# EAGLE design PowerPCB_180 (EAGLE 7.5.0)
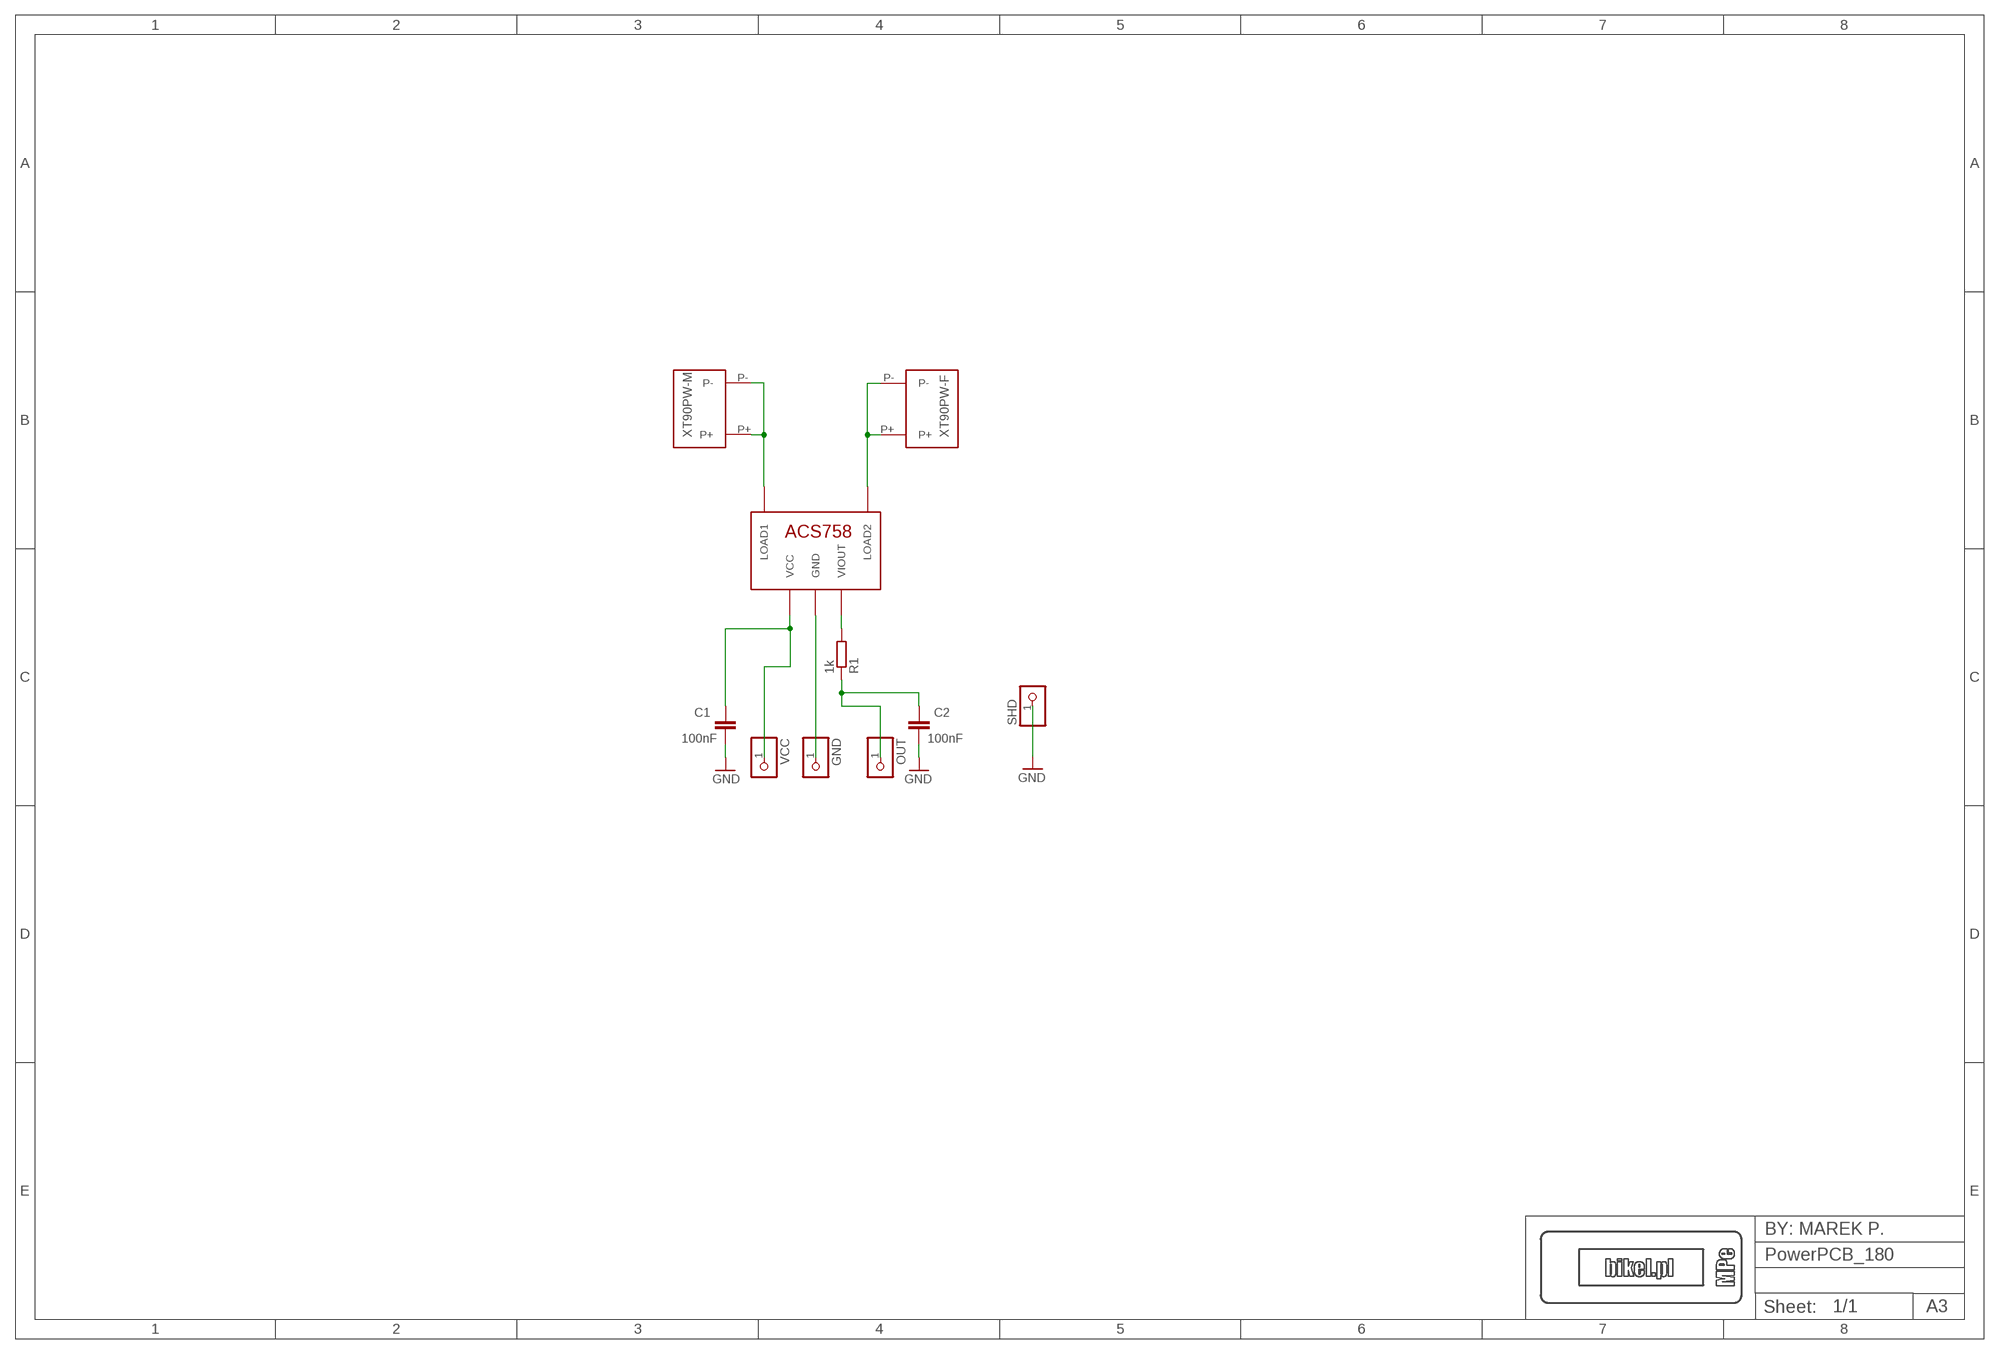
[diagram p0: schematic, sheet 1]

## Parts
ACS758_1  ACS758  [ACS758-PFF]
C1  100nF  C-EUC0805  [C0805]
C2  100nF  C-EUC0805  [C0805]
GND  PINHD-1X1  [1X01]
OUT  PINHD-1X1  [1X01]
R1  1k  R-EU_R0805  [R0805]
SHD  PINHD-1X1  [1X01]
VCC  PINHD-1X1  [1X01]
XT90PW-F1  XT90PW-F  [XT90PW-F]
XT90PW-M1  XT90PW-M  [XT90PW-M]

## Nets
GND: ACS758_1.GND C1.2 C2.2 GND.1 SHD.1
N$1: ACS758_1.VIOUT R1.2
N$2: C2.1 OUT.1 R1.1
N$4: ACS758_1.LOAD1 XT90PW-M1.P+ XT90PW-M1.P-
N$5: ACS758_1.LOAD2 XT90PW-F1.P+ XT90PW-F1.P-
N$8: ACS758_1.VCC C1.1 VCC.1

## Library data of the parts
ACS758_1 = _marek:ACS758
C1 C2 = resistor:C-EU: CAPACITOR, European symbol
GND OUT SHD VCC = pinhead:PINHD-1X1: PIN HEADER
R1 = resistor:R-EU_: RESISTOR, European symbol
XT90PW-F1 = _marek:XT90PW-F
XT90PW-M1 = _marek:XT90PW-M

## Board
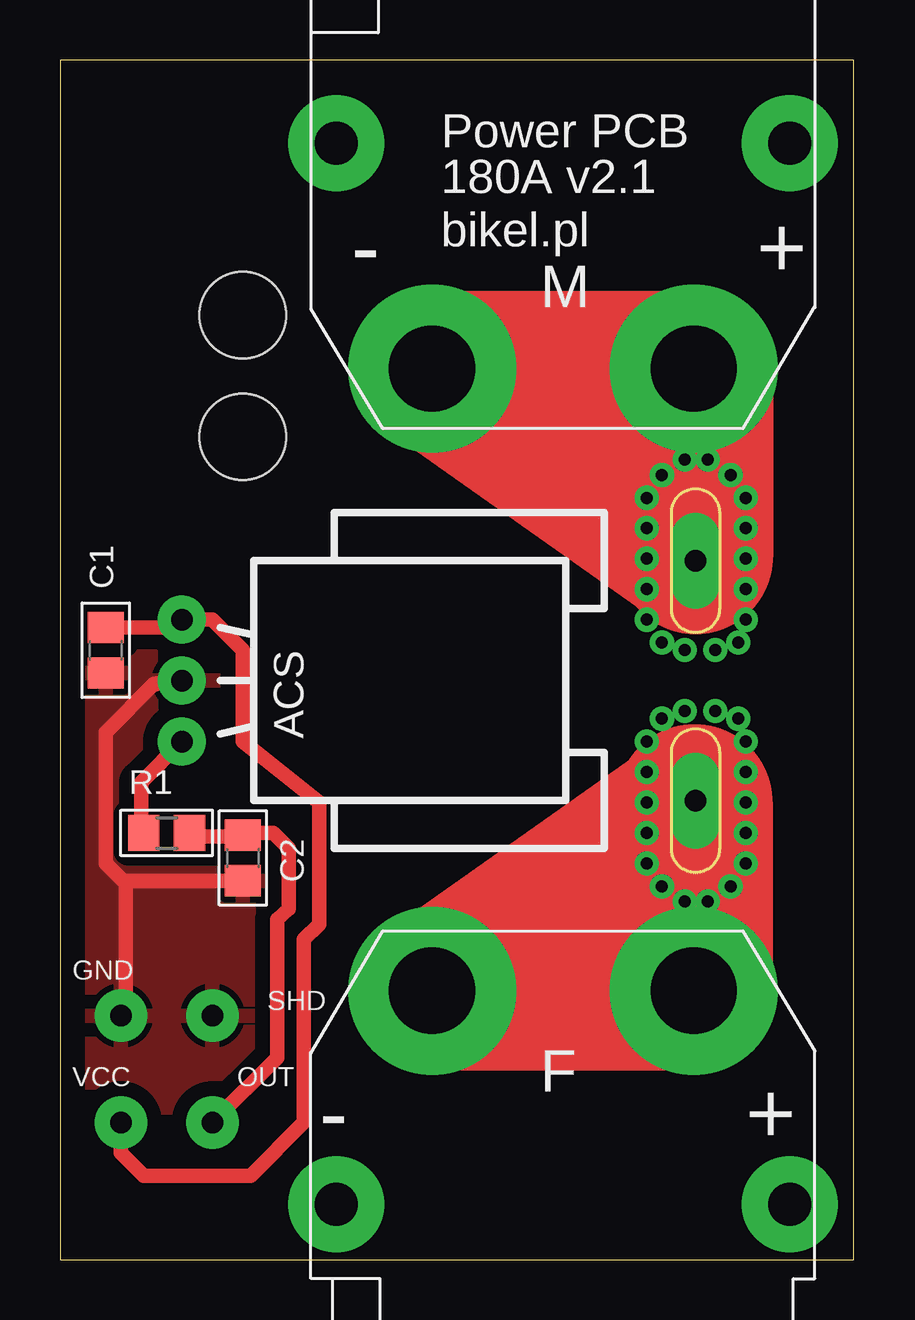
[diagram p1: board, top side]
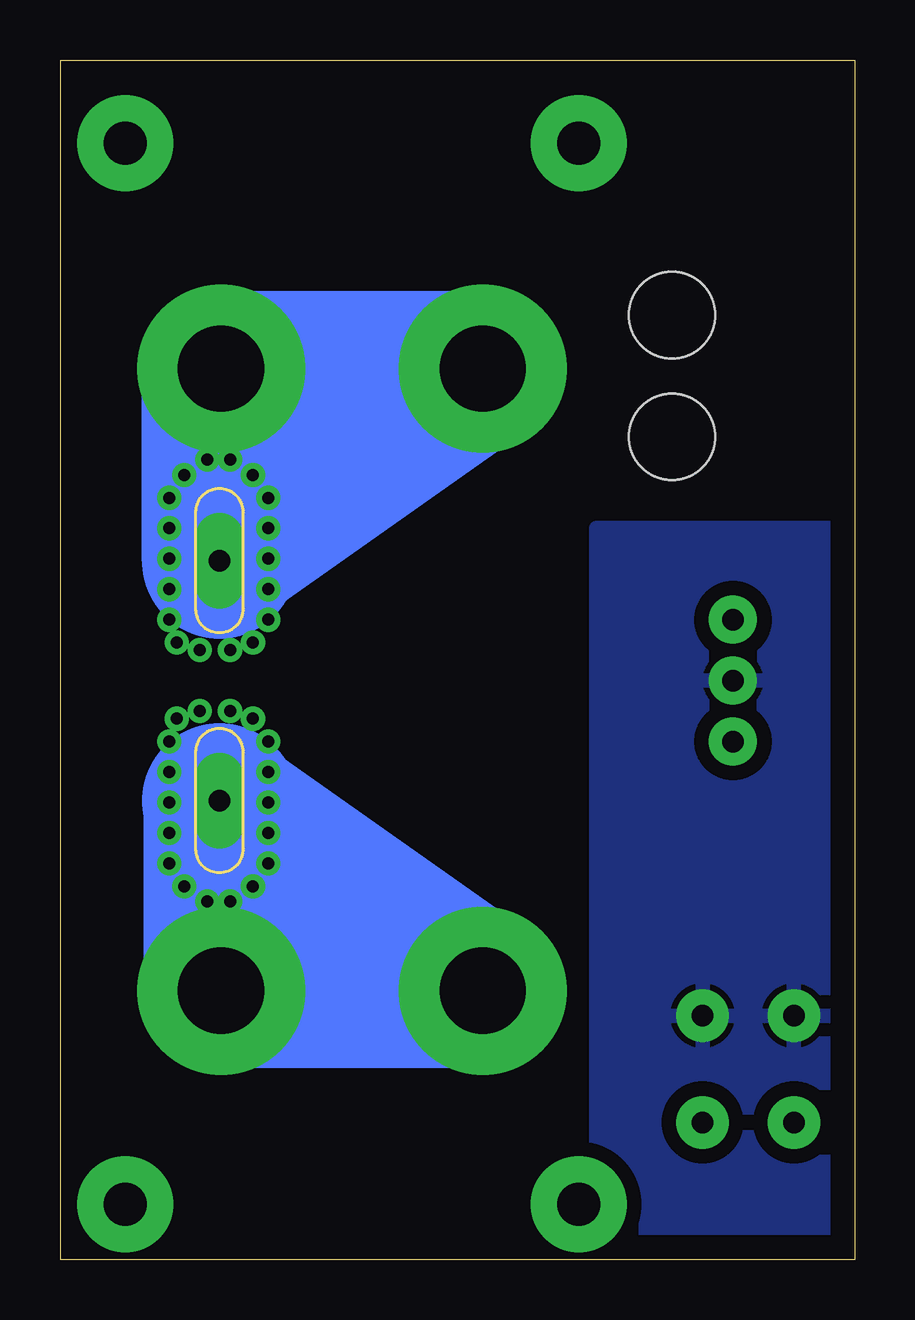
[diagram p2: board, bottom side, seen from below]

Size 33.08 x 50 mm. Coordinates in mm from the lower left corner, seen from the top.
Outline: 0,0 33.08,0 33.08,50 0,50 0,0
Copper layers (1*16): Top 0.035mm / dielectric 1.5mm / Bottom 0.035mm
Design rules "default *": minimum track width 10mil, minimum drill 24mil, track to track 8mil, track to pad 8mil, pad to pad 8mil, via to via 8mil, smd to smd 8mil, copper to edge 40mil, drill to drill 8mil, minimum pad ring 10mil, minimum via ring 8mil, stop-mask expansion 4mil, vias tented up to drill 0.6mm, thermal gap 10mil
Holes 3.6 mm at 7.62,39.37 7.62,34.29

### Footprints (pad centres in the part's own frame; a part is rotated, then mirrored left to right if it is on the bottom)
ACS758-PFF = drill 0.9 pad 2: GND 0,0; VCC -2.54,0; VIOUT 2.54,0 | drill 0.9 pad 2 long: LOAD1 -5,21.4; LOAD2 5,21.4 | drill 0.5 pad 0.61: P$1 -5.08,23.495; P$2 -5.08,19.367; P$3 -1.27,22.225; P$4 -1.27,20.955; P$5 -3.81,23.495; P$6 -2.54,23.495; P$7 -1.587,23.177; P$8 -1.587,20.003; P$9 -2.54,19.367; P$10 -3.81,19.367; P$11 -6.35,19.367; P$12 -7.62,19.367; P$13 -8.572,20.003; P$14 -9.207,20.955; P$15 -9.207,21.907; P$16 -8.572,22.86; P$17 -7.62,23.495; P$18 -6.35,23.495; P$19 1.587,23.177; P$20 2.54,23.495; P$21 3.81,23.495; P$22 5.08,23.495; P$23 6.35,23.495; P$24 7.62,23.495; P$25 8.572,22.86; P$26 9.207,21.907; P$27 9.207,20.955; P$28 8.572,20.003; P$29 7.62,19.367; P$30 6.35,19.367; P$31 5.08,19.367; P$32 3.81,19.367; P$33 2.54,19.367; P$34 1.587,20.003; P$35 1.27,20.955; P$36 1.27,22.225
C0805 = smd 1.3 x 1.5: 1 -0.95,0; 2 0.95,0
1X01 = drill 0.9 pad 2.184: 1 0,0
R0805 = smd 1.3 x 1.5: 1 -0.95,0; 2 0.95,0
XT90PW-F = drill 1.8 pad 4: P$3 -9.45,-8.9; P$4 9.45,-8.9 | drill 3.6 pad 7: P+ 5.45,0; P- -5.45,0
XT90PW-M = drill 1.8 pad 4: P$3 -9.45,-9.4; P$4 9.45,-9.4 | drill 3.6 pad 7: P+ -5.45,0; P- 5.45,0

### Placement (x,y rotation side)
ACS758_1  5.08,24.13 270 top
C1  1.91,25.4 270 top
C2  7.62,16.74 270 top
GND  2.54,10.16 0 top
OUT  6.35,5.71 0 top
R1  4.45,17.78 180 top
SHD  6.35,10.16 0 top
VCC  2.54,5.71 0 top
XT90PW-F1  20.95,11.2 0 top
XT90PW-M1  20.95,37.13 180 top

### Tracks (layer width: path | path; a pad name or v marks a point on that pad's centre or on a via)
GND
  Top 0.254: 5.05,24 ACS758_1.GND 5.28,24.23
  Top 0.61: 5.05,24 4,24 3.97,23.97 3.9,23.98 1.91,21.96 1.91,16.51 2.63,15.79 | 2.63,15.79 C2.2 | 2.74,10.26 2.74,15.67 2.63,15.79
  Bottom 0.61: 5.28,24.23 ACS758_1.GND
  pour Top (isolate 0.61): -2.54,31.75 11.43,31.75 11.43,-1.27 -2.54,-1.27
  pour Bottom (isolate 0.61): -0.64,30.48 10.77,30.48 10.77,-0.18 -0.64,0
N$1
  Top 0.254: 3.38,17.83 R1.2
  Top 0.61: 3.38,17.83 3.38,19.89 ACS758_1.VIOUT
N$2
  Top 0.254: 7.44,17.63 C2.1
  Top 0.61: 7.44,17.63 5.39,17.63 R1.1 | C2.1 7.71,17.78 8.89,17.78 9.53,17.14 9.53,14.61 9.04,14.17 9.04,8.41 OUT.1
N$3
  Bottom 6.452: 15.56,37.15 26.35,29.53
N$4
  Bottom 6.452: 26.48,29.11 ACS758_1.LOAD1 26.48,37.06 XT90PW-M1.P+ XT90PW-M1.P-
N$5
  Bottom 6.452: ACS758_1.LOAD2 26.41,19.05 XT90PW-F1.P+ XT90PW-F1.P-
N$6
  Top 6.452: 26.42,19.07 26.47,19.07 26.47,11.18
N$7
  Top 6.452: 26.48,37.21 26.48,29.29
N$8
  Top 0.61: VCC.1 2.54,4.45 3.49,3.49 7.94,3.49 10.16,5.71 10.16,13.34 10.79,13.97 10.79,19.05 7.62,21.59 7.62,25.4 6.35,26.67 ACS758_1.VCC 4.76,26.35 C1.1
N$9
  Bottom 6.452: 15.56,11.11 26.35,18.73
N$10
  Top 6.452: 26.67,37.15 15.56,37.15 26.35,29.53
N$11
  Top 6.452: 26.35,11.11 15.56,11.11 26.35,18.73

### Text on the board
tPlace: M | F
tNames: Power PCB | 180A v2.1 | bikel.pl